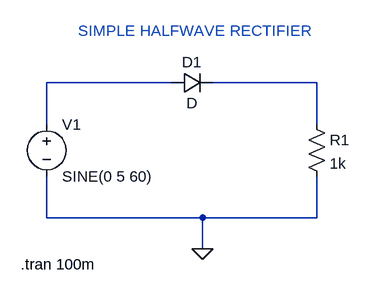
[diagram p0: schematic Simple halfwave rectifier.asc]
Simple halfwave rectifier.asc, the LTspice schematic file:
Version 4
SHEET 1 880 680
WIRE 256 64 64 64
WIRE 480 64 320 64
WIRE 64 128 64 64
WIRE 480 128 480 64
WIRE 64 272 64 208
WIRE 304 272 64 272
WIRE 480 272 480 208
WIRE 480 272 304 272
WIRE 304 320 304 272
FLAG 304 320 0
SYMBOL voltage 64 112 R0
WINDOW 123 0 0 Left 0
WINDOW 39 0 0 Left 0
SYMATTR InstName V1
SYMATTR Value SINE(0 5 60)
SYMBOL diode 256 80 R270
WINDOW 0 32 32 VTop 2
WINDOW 3 0 32 VBottom 2
SYMATTR InstName D1
SYMBOL res 464 112 R0
SYMATTR InstName R1
SYMATTR Value 1k
TEXT 112 -16 Left 2 ;SIMPLE HALFWAVE RECTIFIER
TEXT 24 344 Left 2 !.tran 100m

The netlist it stands for:
* Simple halfwave rectifier.asc
V1 N001 0 SINE(0 5 60)
D1 N001 N002 D
R1 N002 0 1k
.model D D
.lib standard.dio
* SIMPLE HALFWAVE RECTIFIER
.tran 100m
.backanno
.end